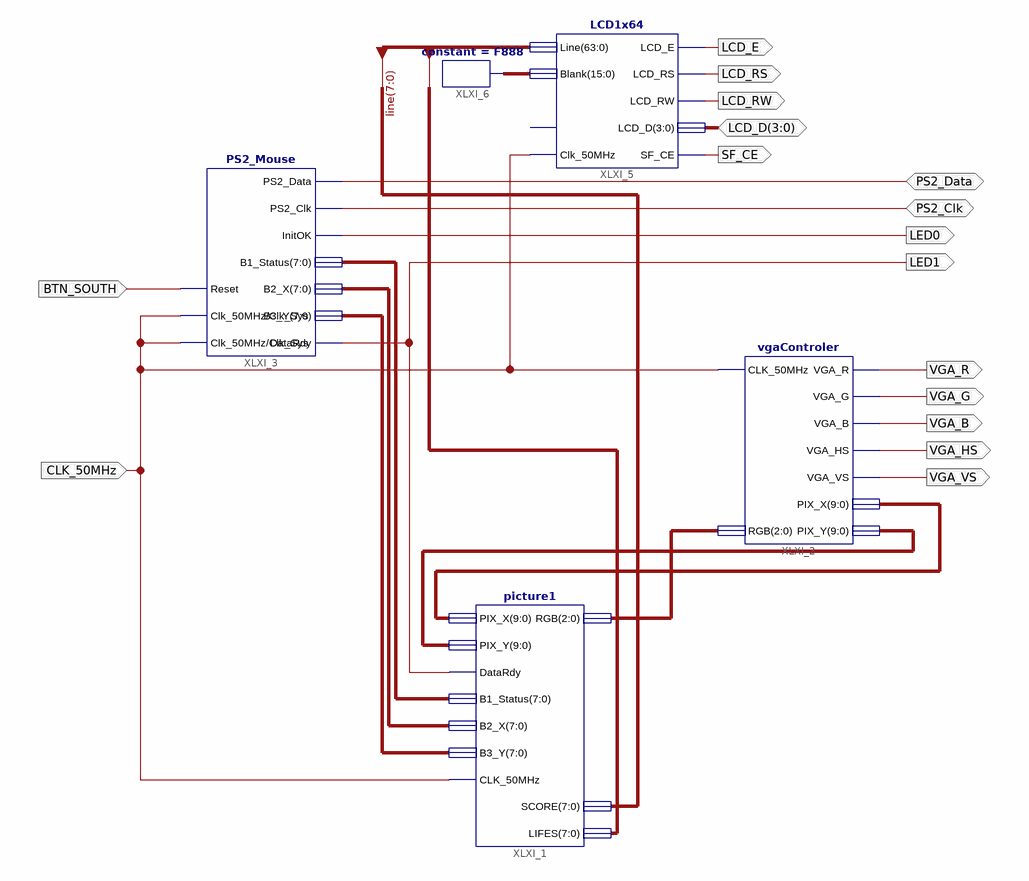
[diagram p0: schematic sheet 1]
// Xilinx ISE schematic schematvga.sch (spartan3e) as structural Verilog: 5 symbols, 16 ports
module schematvga (
  input  CLK_50MHz,
  input  BTN_SOUTH,
  inout  PS2_Clk,
  inout  PS2_Data,
  inout  [3:0] LCD_D,
  output VGA_R,
  output VGA_G,
  output VGA_B,
  output VGA_HS,
  output VGA_VS,
  output LED0,
  output LED1,
  output LCD_E,
  output LCD_RS,
  output LCD_RW,
  output SF_CE
);

  wire [2:0] XLXN_1;
  wire [7:0] XLXN_78, XLXN_79, XLXN_80;
  wire [9:0] XLXN_2, XLXN_71;
  wire [15:0] XLXN_70;
  wire [63:0] line;

  PS2_Mouse XLXI_3 (
    .PS2_Data(PS2_Data), .PS2_Clk(PS2_Clk), .InitOK(LED0), .DataRdy(LED1), .B1_Status(XLXN_78),
    .B2_X(XLXN_79), .B3_Y(XLXN_80), .Clk_50MHz(CLK_50MHz), .Reset(BTN_SOUTH), .Clk_Sys(CLK_50MHz));
  vgaControler XLXI_2 (
    .CLK_50MHz(CLK_50MHz), .RGB(XLXN_1), .VGA_R(VGA_R), .VGA_G(VGA_G), .VGA_B(VGA_B), .VGA_HS(VGA_HS),
    .VGA_VS(VGA_VS), .PIX_X(XLXN_2), .PIX_Y(XLXN_71));
  LCD1x64 XLXI_5 (
    .Clk_50MHz(CLK_50MHz), .Line(line), .Blank(XLXN_70), .LCD_D(LCD_D), .LCD_E(LCD_E), .LCD_RW(LCD_RW),
    .LCD_RS(LCD_RS), .SF_CE(SF_CE));  // open: Reset
  constant #(.CValue("F888")) XLXI_6 (.O(XLXN_70));
  picture1 XLXI_1 (
    .DataRdy(LED1), .CLK_50MHz(CLK_50MHz), .PIX_X(XLXN_2), .PIX_Y(XLXN_71), .B1_Status(XLXN_78),
    .B2_X(XLXN_79), .B3_Y(XLXN_80), .SCORE(line[7:0]), .RGB(XLXN_1), .LIFES(line[15:8]));
endmodule
